# Altium schematic sheet DRIVER POWER SUPPLY MODULE.SchDoc
size 1600 x 1200 mm; SheetNumber: 1; SheetTotal: 1; SPICEModelCacheBTRAQOWF: <root> / <DocumentId>BTRAQOWF</DocumentId> / </root>
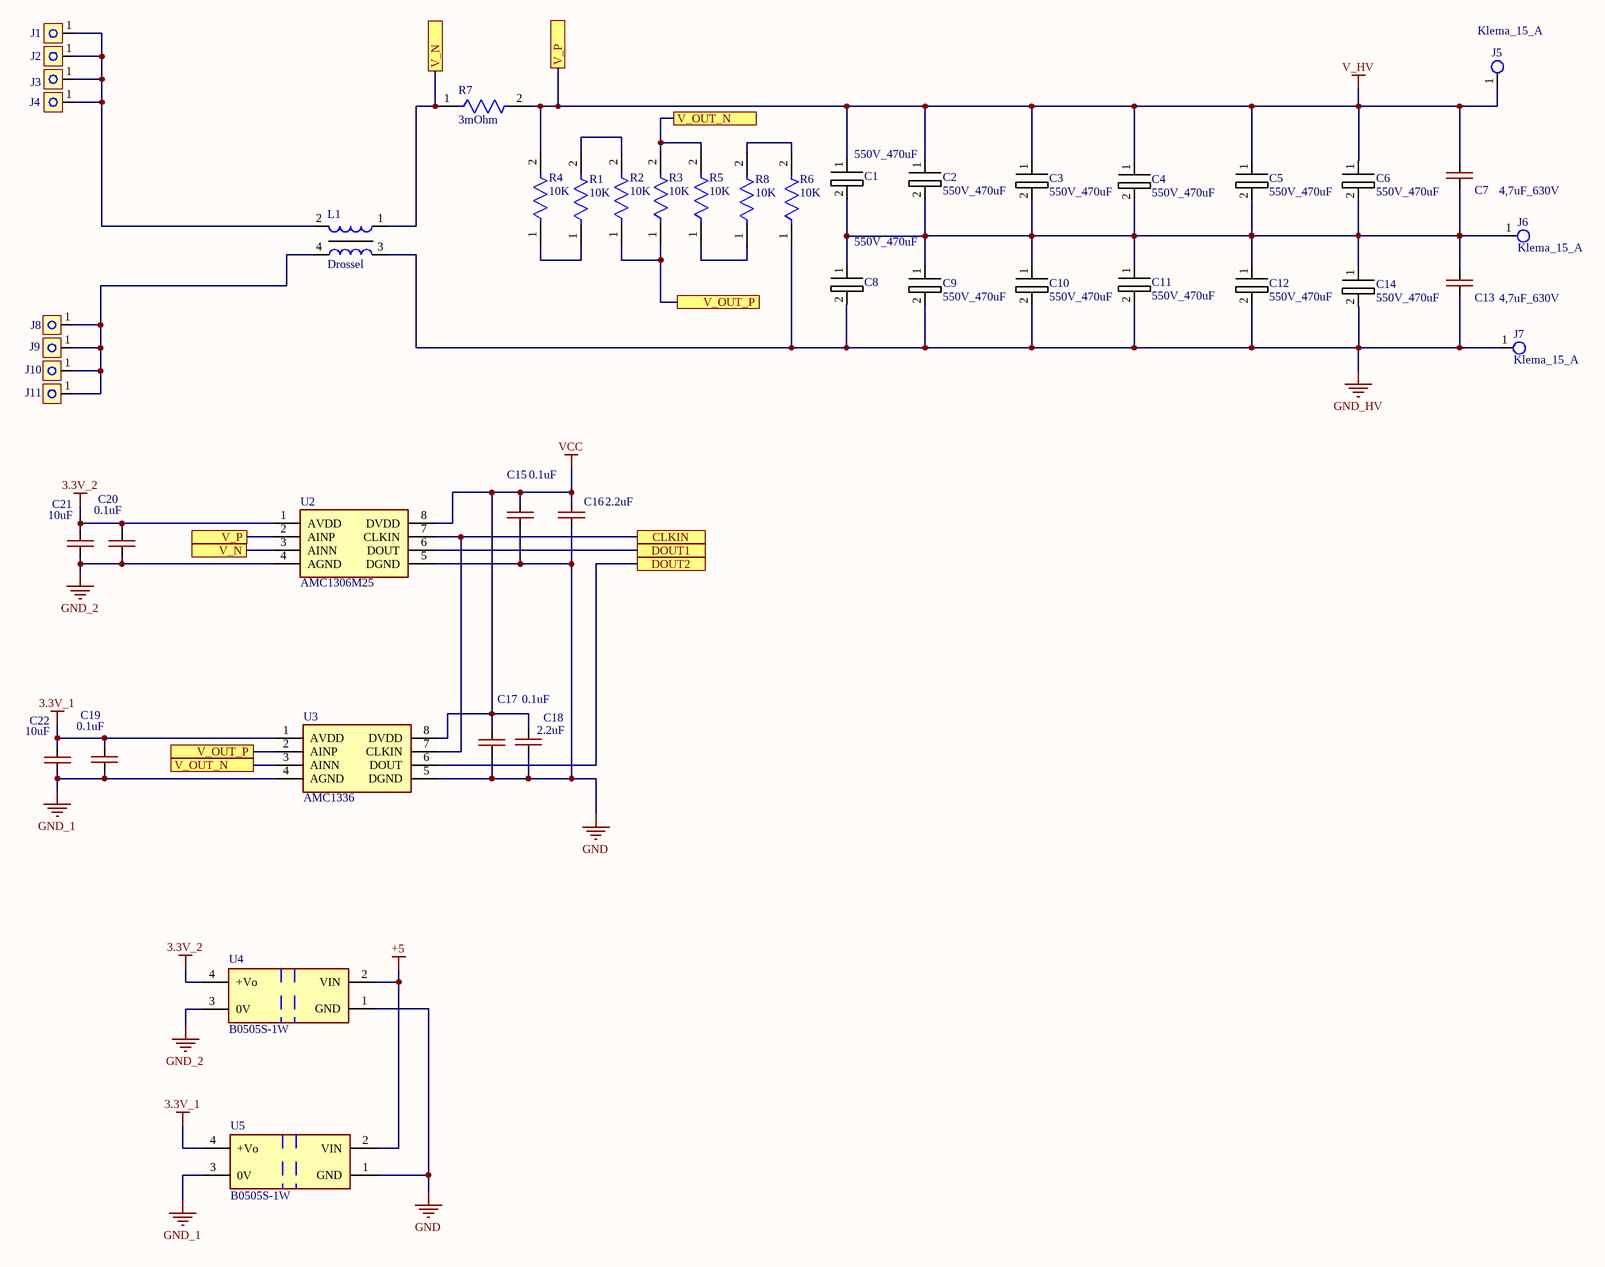
[diagram p0: DRIVER POWER SUPPLY MODULE.SchDoc]

## Parts
C1  550V_470uF  [500V_470uF]
C2  550V_470uF  [500V_470uF]
C3  550V_470uF  [500V_470uF]
C4  550V_470uF  [500V_470uF]
C5  550V_470uF  [500V_470uF]
C6  550V_470uF  [500V_470uF]
C7  4,7uF_630V  [CAP_4.7uF_630V]
C8  550V_470uF  [500V_470uF]
C9  550V_470uF  [500V_470uF]
C10  550V_470uF  [500V_470uF]
C11  550V_470uF  [500V_470uF]
C12  550V_470uF  [500V_470uF]
C13  4,7uF_630V  [CAP_4.7uF_630V]
C14  550V_470uF  [500V_470uF]
C15  0.1uF  [CAP-0603]
C16  2.2uF  [CAP-0603]
C17  0.1uF  [CAP-0603]
C18  2.2uF  [CAP-0603]
C19  0.1uF  [CAP-0603]
C20  0.1uF  [CAP-0603]
C21  10uF  [CAP-0603]
C22  10uF  [CAP-0603]
J1  MG_136_HT  [Conn_MEIGAN_MG136HT]  (value not drawn)
J2  MG_136_HT  [Conn_MEIGAN_MG136HT]  (value not drawn)
J3  MG_136_HT  [Conn_MEIGAN_MG136HT]  (value not drawn)
J4  MG_136_HT  [Conn_MEIGAN_MG136HT]  (value not drawn)
J5  Klema_15_A  [M8 Conn]
J6  Klema_15_A  [M8 Conn]
J7  Klema_15_A  [M8 Conn]
J8  MG_136_HT  [Conn_MEIGAN_MG136HT]  (value not drawn)
J9  MG_136_HT  [Conn_MEIGAN_MG136HT]  (value not drawn)
J10  MG_136_HT  [Conn_MEIGAN_MG136HT]  (value not drawn)
J11  MG_136_HT  [Conn_MEIGAN_MG136HT]  (value not drawn)
L1  Drossel  [Drossel_Synphaze]
R1  10K  [RES-2512]
R2  10K  [RES-2512]
R3  10K  [RES-2512]
R4  10K  [RES-2512]
R5  10K  [RES-2512]
R6  10K  [RES-2512]
R7  3mOhm  [RES-3921]
R8  10K  [RES-2512]
U2  AMC1306M25  [FP-DWV0008A-MFG]
U3  AMC1336  [FP-DWV0008A-MFG]
U4  B0505S-1W  [B0505S-1W]
U5  B0505S-1W  [B0505S-1W]

## Ports
CLKIN, DOUT1, DOUT2, V_N, V_OUT_N, V_OUT_P, V_P

## Nets
3.3V_1: C19.1 C22.1 U3.1(AVDD) U5.4(+Vo)
3.3V_2: C20.1 C21.1 U2.1(AVDD) U4.4(+Vo)
+5: U4.2(VIN) U5.2(VIN)
GND: C15.2 C16.2 C17.2 C18.2 U2.5(DGND) U3.5(DGND) U4.1(GND) U5.1(GND)
GND_1: C19.2 C22.2 U3.4(AGND) U5.3(0V)
GND_2: C20.2 C21.2 U2.4(AGND) U4.3(0V)
GND_HV: C8.2 C9.2 C10.2 C11.2 C12.2 C13.1 C14.2 J7.1 L1.3 R6.1
V_HV: C1.1 C2.1 C3.1 C4.1 C5.1 C6.1 C7.2 J5.1 R4.2 R7.2 U2.2(AINP) ; port V_P
VCC: C15.1 C16.1 C17.1 C18.1 U2.8(DVDD) U3.8(DVDD)
CLKIN: U2.7(CLKIN) U3.7(CLKIN) ; port CLKIN
DOUT1: U2.6(DOUT) ; port DOUT1
DOUT2: U3.6(DOUT) ; port DOUT2
V_N: L1.1 R7.1 U2.3(AINN) ; port V_N
V_OUT_N: R3.2 R5.2 U3.3(AINN) ; port V_OUT_N
V_OUT_P: R2.1 R3.1 U3.2(AINP) ; port V_OUT_P
NetC1_2: C1.2 C2.2 C3.2 C4.2 C5.2 C6.2 C7.1 C8.1 C9.1 C10.1 C11.1 C12.1 C13.2 C14.1 J6.1
NetJ1_1: J1.1 J2.1 J3.1 J4.1 L1.2
NetJ8_1: J8.1 J9.1 J10.1 J11.1 L1.4
NetR1_1: R1.1 R4.1
NetR1_2: R1.2 R2.2
NetR5_1: R5.1 R8.1
NetR6_2: R6.2 R8.2

## Library data of the parts
C1-C6 C8-C12 C14 = CAP_POL_LOW_IMP
C7 C13 C15-C22 = CAP-NON-POLAR
J1-J4 J8-J11 = Connector_MEIGAN_MG136HT
L1 = Drossel_Synphaze
R1-R8 = RES-CONST